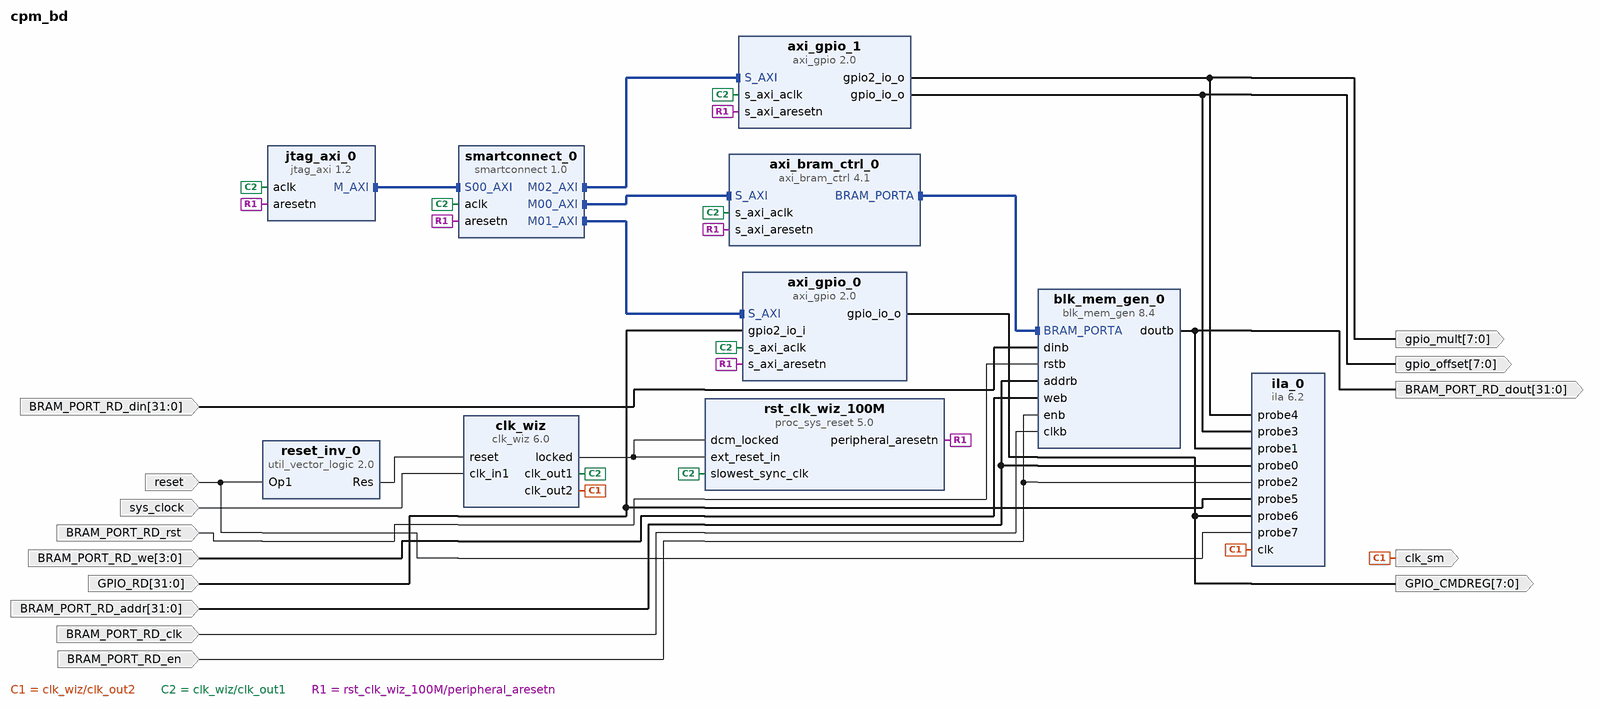
[diagram p0: block diagram of the top level]
# Vivado block design cpm_bd, xc7a100tcsg324-1, Vivado 2022.1
create_bd_design cpm_bd

create_bd_port -dir I -type clk sys_clock
set_property -dict {CONFIG.ASSOCIATED_RESET reset_0 CONFIG.FREQ_HZ 100000000 CONFIG.PHASE 0.0} [get_bd_ports sys_clock]
create_bd_port -dir I -type rst reset
set_property -dict {CONFIG.POLARITY ACTIVE_LOW} [get_bd_ports reset]
create_bd_port -dir O -type clk clk_sm
create_bd_port -dir O -from 7 -to 0 gpio_offset
create_bd_port -dir O -from 7 -to 0 GPIO_CMDREG
create_bd_port -dir O -from 7 -to 0 gpio_mult
create_bd_port -dir I -type clk BRAM_PORT_RD_clk
create_bd_port -dir I -from 31 -to 0 BRAM_PORT_RD_din
create_bd_port -dir I -from 31 -to 0 BRAM_PORT_RD_addr
create_bd_port -dir O -from 31 -to 0 BRAM_PORT_RD_dout
create_bd_port -dir I BRAM_PORT_RD_en
create_bd_port -dir I -type rst BRAM_PORT_RD_rst
set_property -dict {CONFIG.POLARITY ACTIVE_HIGH} [get_bd_ports BRAM_PORT_RD_rst]
create_bd_port -dir I -from 3 -to 0 BRAM_PORT_RD_we
create_bd_port -dir I -from 31 -to 0 GPIO_RD

create_bd_cell -type ip -vlnv xilinx.com:ip:jtag_axi:1.2 jtag_axi_0
set_property -dict {CONFIG.PROTOCOL 2} [get_bd_cells jtag_axi_0]
create_bd_cell -type ip -vlnv xilinx.com:ip:axi_gpio:2.0 axi_gpio_0
set_property -dict [list \
  CONFIG.C_ALL_INPUTS 0 \
  CONFIG.C_ALL_INPUTS_2 1 \
  CONFIG.C_ALL_OUTPUTS 1 \
  CONFIG.C_GPIO2_WIDTH 32 \
  CONFIG.C_GPIO_WIDTH 8 \
  CONFIG.C_IS_DUAL 1 \
] [get_bd_cells axi_gpio_0]
create_bd_cell -type ip -vlnv xilinx.com:ip:axi_gpio:2.0 axi_gpio_1
set_property -dict [list \
  CONFIG.C_ALL_OUTPUTS 1 \
  CONFIG.C_ALL_OUTPUTS_2 1 \
  CONFIG.C_GPIO2_WIDTH 8 \
  CONFIG.C_GPIO_WIDTH 8 \
  CONFIG.C_INTERRUPT_PRESENT 0 \
  CONFIG.C_IS_DUAL 1 \
] [get_bd_cells axi_gpio_1]
create_bd_cell -type ip -vlnv xilinx.com:ip:axi_bram_ctrl:4.1 axi_bram_ctrl_0
set_property -dict {CONFIG.PROTOCOL AXI4LITE CONFIG.SINGLE_PORT_BRAM 1} [get_bd_cells axi_bram_ctrl_0]
create_bd_cell -type ip -vlnv xilinx.com:ip:blk_mem_gen:8.4 blk_mem_gen_0
set_property -dict [list \
  CONFIG.Enable_B Use_ENB_Pin \
  CONFIG.Memory_Type True_Dual_Port_RAM \
  CONFIG.Port_B_Clock 100 \
  CONFIG.Port_B_Enable_Rate 100 \
  CONFIG.Port_B_Write_Rate 50 \
  CONFIG.Use_RSTB_Pin true \
] [get_bd_cells blk_mem_gen_0]
create_bd_cell -type ip -vlnv xilinx.com:ip:clk_wiz:6.0 clk_wiz
set_property -dict [list \
  CONFIG.CLKIN2_JITTER_PS 166.66 \
  CONFIG.CLKOUT1_JITTER 130.067 \
  CONFIG.CLKOUT1_PHASE_ERROR 99.281 \
  CONFIG.CLKOUT2_JITTER 138.050 \
  CONFIG.CLKOUT2_PHASE_ERROR 99.281 \
  CONFIG.CLKOUT2_REQUESTED_OUT_FREQ 75 \
  CONFIG.CLKOUT2_USED true \
  CONFIG.CLK_IN1_BOARD_INTERFACE sys_clock \
  CONFIG.MMCM_CLKFBOUT_MULT_F 9.750 \
  CONFIG.MMCM_CLKIN2_PERIOD 10.000 \
  CONFIG.MMCM_CLKOUT0_DIVIDE_F 9.750 \
  CONFIG.MMCM_CLKOUT1_DIVIDE 13 \
  CONFIG.NUM_OUT_CLKS 2 \
  CONFIG.RESET_BOARD_INTERFACE reset \
  CONFIG.SECONDARY_SOURCE Single_ended_clock_capable_pin \
  CONFIG.USE_BOARD_FLOW true \
  CONFIG.USE_INCLK_SWITCHOVER false \
] [get_bd_cells clk_wiz]
create_bd_cell -type ip -vlnv xilinx.com:ip:proc_sys_reset:5.0 rst_clk_wiz_100M
set_property -dict {CONFIG.RESET_BOARD_INTERFACE reset CONFIG.USE_BOARD_FLOW true} [get_bd_cells rst_clk_wiz_100M]
create_bd_cell -type ip -vlnv xilinx.com:ip:smartconnect:1.0 smartconnect_0
set_property -dict {CONFIG.NUM_MI 3 CONFIG.NUM_SI 1} [get_bd_cells smartconnect_0]
create_bd_cell -type ip -vlnv xilinx.com:ip:util_vector_logic:2.0 reset_inv_0
set_property -dict {CONFIG.C_OPERATION not CONFIG.C_SIZE 1} [get_bd_cells reset_inv_0]
create_bd_cell -type ip -vlnv xilinx.com:ip:ila:6.2 ila_0
set_property -dict [list \
  CONFIG.ALL_PROBE_SAME_MU true \
  CONFIG.C_ENABLE_ILA_AXI_MON false \
  CONFIG.C_MONITOR_TYPE Native \
  CONFIG.C_NUM_OF_PROBES 8 \
  CONFIG.C_PROBE0_WIDTH 32 \
  CONFIG.C_PROBE1_WIDTH 32 \
  CONFIG.C_PROBE3_WIDTH 8 \
  CONFIG.C_PROBE4_WIDTH 8 \
  CONFIG.C_PROBE5_WIDTH 32 \
  CONFIG.C_PROBE6_WIDTH 8 \
  CONFIG.C_PROBE8_WIDTH 1 \
] [get_bd_cells ila_0]

# ---- connections ----

connect_bd_intf_net [get_bd_intf_pins blk_mem_gen_0/BRAM_PORTA] [get_bd_intf_pins axi_bram_ctrl_0/BRAM_PORTA]
connect_bd_intf_net [get_bd_intf_pins smartconnect_0/S00_AXI] [get_bd_intf_pins jtag_axi_0/M_AXI]
connect_bd_intf_net [get_bd_intf_pins smartconnect_0/M00_AXI] [get_bd_intf_pins axi_bram_ctrl_0/S_AXI]
connect_bd_intf_net [get_bd_intf_pins smartconnect_0/M01_AXI] [get_bd_intf_pins axi_gpio_0/S_AXI]
connect_bd_intf_net [get_bd_intf_pins smartconnect_0/M02_AXI] [get_bd_intf_pins axi_gpio_1/S_AXI]
connect_bd_net [get_bd_ports BRAM_PORT_RD_din] [get_bd_pins blk_mem_gen_0/dinb]
connect_bd_net [get_bd_ports BRAM_PORT_RD_rst] [get_bd_pins blk_mem_gen_0/rstb]
connect_bd_net [get_bd_ports BRAM_PORT_RD_we] [get_bd_pins blk_mem_gen_0/web]
connect_bd_net [get_bd_ports BRAM_PORT_RD_addr] [get_bd_pins ila_0/probe0] [get_bd_pins blk_mem_gen_0/addrb]
connect_bd_net [get_bd_ports BRAM_PORT_RD_clk] [get_bd_pins blk_mem_gen_0/clkb]
connect_bd_net -net bram_port_rd_dout [get_bd_pins blk_mem_gen_0/doutb] [get_bd_pins ila_0/probe1] [get_bd_ports BRAM_PORT_RD_dout]
connect_bd_net [get_bd_ports BRAM_PORT_RD_en] [get_bd_pins ila_0/probe2] [get_bd_pins blk_mem_gen_0/enb]
connect_bd_net -net clk_sm [get_bd_pins clk_wiz/clk_out2] [get_bd_ports clk_sm] [get_bd_pins ila_0/clk]
connect_bd_net [get_bd_pins clk_wiz/clk_out1] \
  [get_bd_pins jtag_axi_0/aclk] [get_bd_pins rst_clk_wiz_100M/slowest_sync_clk] [get_bd_pins axi_bram_ctrl_0/s_axi_aclk] \
  [get_bd_pins axi_gpio_0/s_axi_aclk] [get_bd_pins axi_gpio_1/s_axi_aclk] [get_bd_pins smartconnect_0/aclk]
connect_bd_net [get_bd_pins clk_wiz/locked] [get_bd_pins rst_clk_wiz_100M/dcm_locked] [get_bd_pins rst_clk_wiz_100M/ext_reset_in]
connect_bd_net -net gpio_cmdreg [get_bd_pins axi_gpio_0/gpio_io_o] [get_bd_pins ila_0/probe6] [get_bd_ports GPIO_CMDREG]
connect_bd_net -net gpio_mult [get_bd_pins axi_gpio_1/gpio2_io_o] [get_bd_pins ila_0/probe4] [get_bd_ports gpio_mult]
connect_bd_net -net gpio_offset [get_bd_pins axi_gpio_1/gpio_io_o] [get_bd_pins ila_0/probe3] [get_bd_ports gpio_offset]
connect_bd_net [get_bd_ports GPIO_RD] [get_bd_pins axi_gpio_0/gpio2_io_i] [get_bd_pins ila_0/probe5]
connect_bd_net [get_bd_ports reset] [get_bd_pins reset_inv_0/Op1] [get_bd_pins ila_0/probe7]
connect_bd_net [get_bd_pins reset_inv_0/Res] [get_bd_pins clk_wiz/reset]
connect_bd_net [get_bd_pins rst_clk_wiz_100M/peripheral_aresetn] \
  [get_bd_pins jtag_axi_0/aresetn] [get_bd_pins axi_bram_ctrl_0/s_axi_aresetn] [get_bd_pins axi_gpio_0/s_axi_aresetn] \
  [get_bd_pins axi_gpio_1/s_axi_aresetn] [get_bd_pins smartconnect_0/aresetn]
connect_bd_net [get_bd_ports sys_clock] [get_bd_pins clk_wiz/clk_in1]

# ---- address map ----
assign_bd_address -offset 0x40000000 -range 128 -target_address_space [get_bd_addr_spaces jtag_axi_0/Data] [get_bd_addr_segs axi_gpio_0/S_AXI/Reg]
assign_bd_address -offset 0x40010000 -range 128 -target_address_space [get_bd_addr_spaces jtag_axi_0/Data] [get_bd_addr_segs axi_gpio_1/S_AXI/Reg]
assign_bd_address -offset 0xC0000000 -range 128 -target_address_space [get_bd_addr_spaces jtag_axi_0/Data] [get_bd_addr_segs axi_bram_ctrl_0/S_AXI/Mem0]

validate_bd_design
save_bd_design
